# EAGLE design Peripherals (EAGLE 9.0.0)
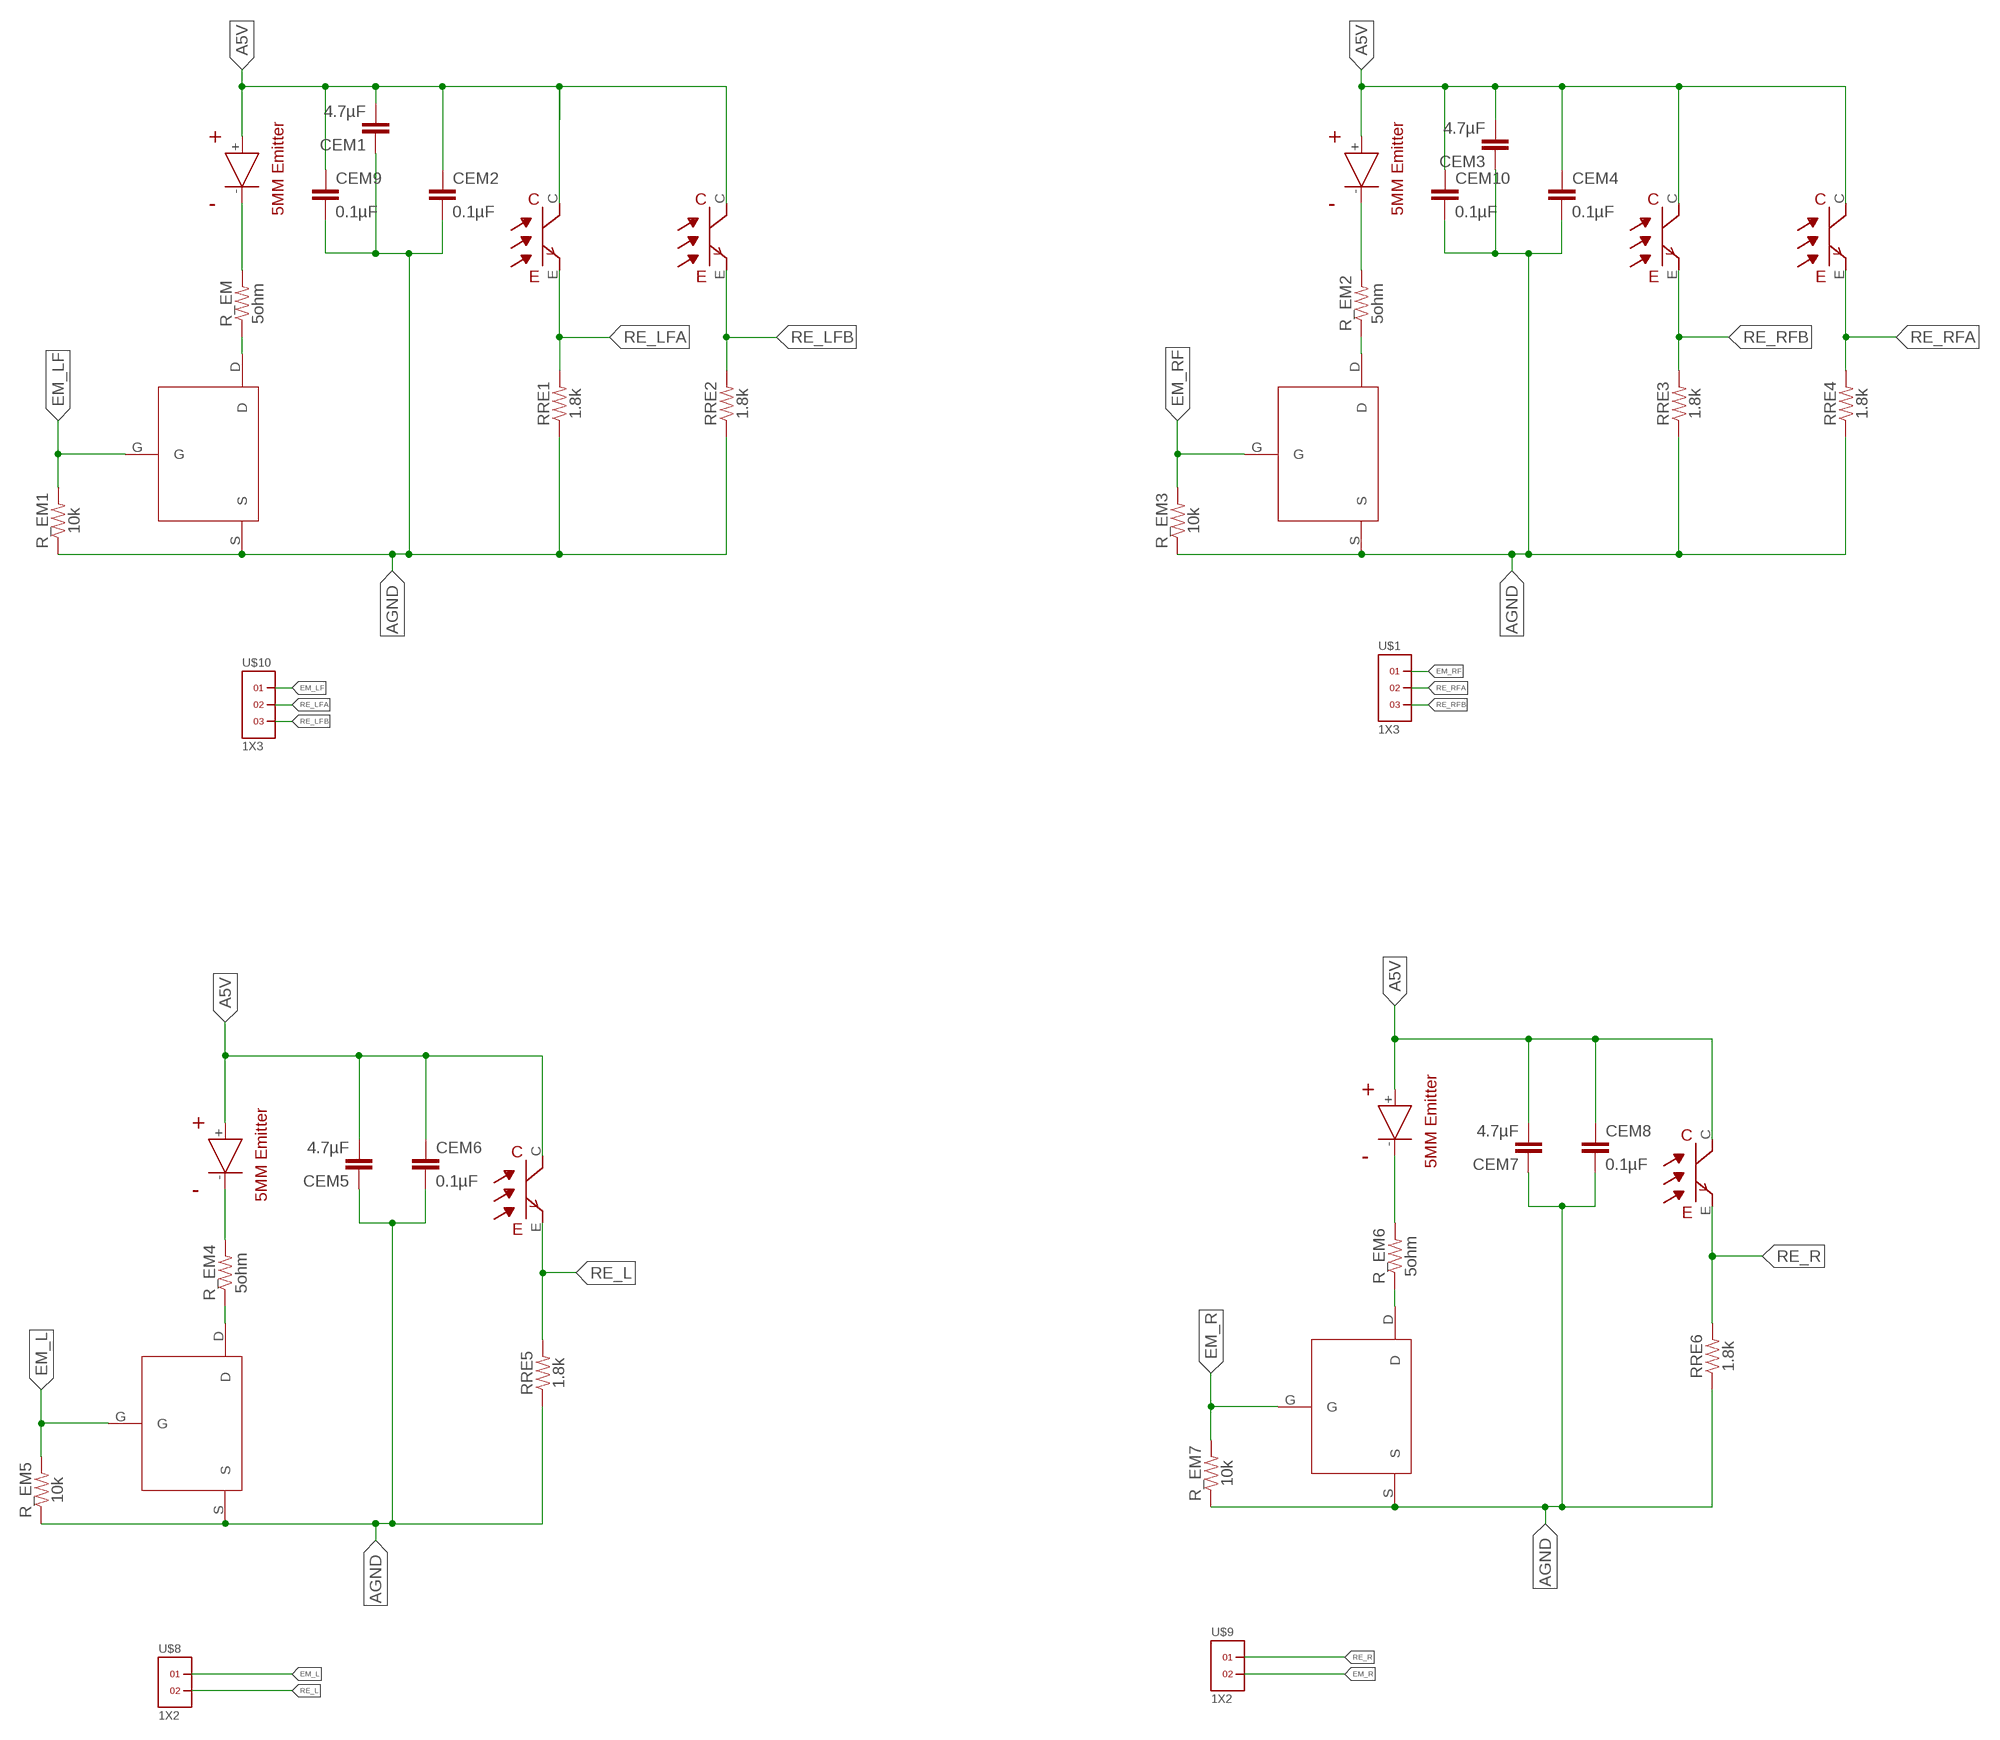
[diagram p0: schematic, sheet 1, part 1 of 2]
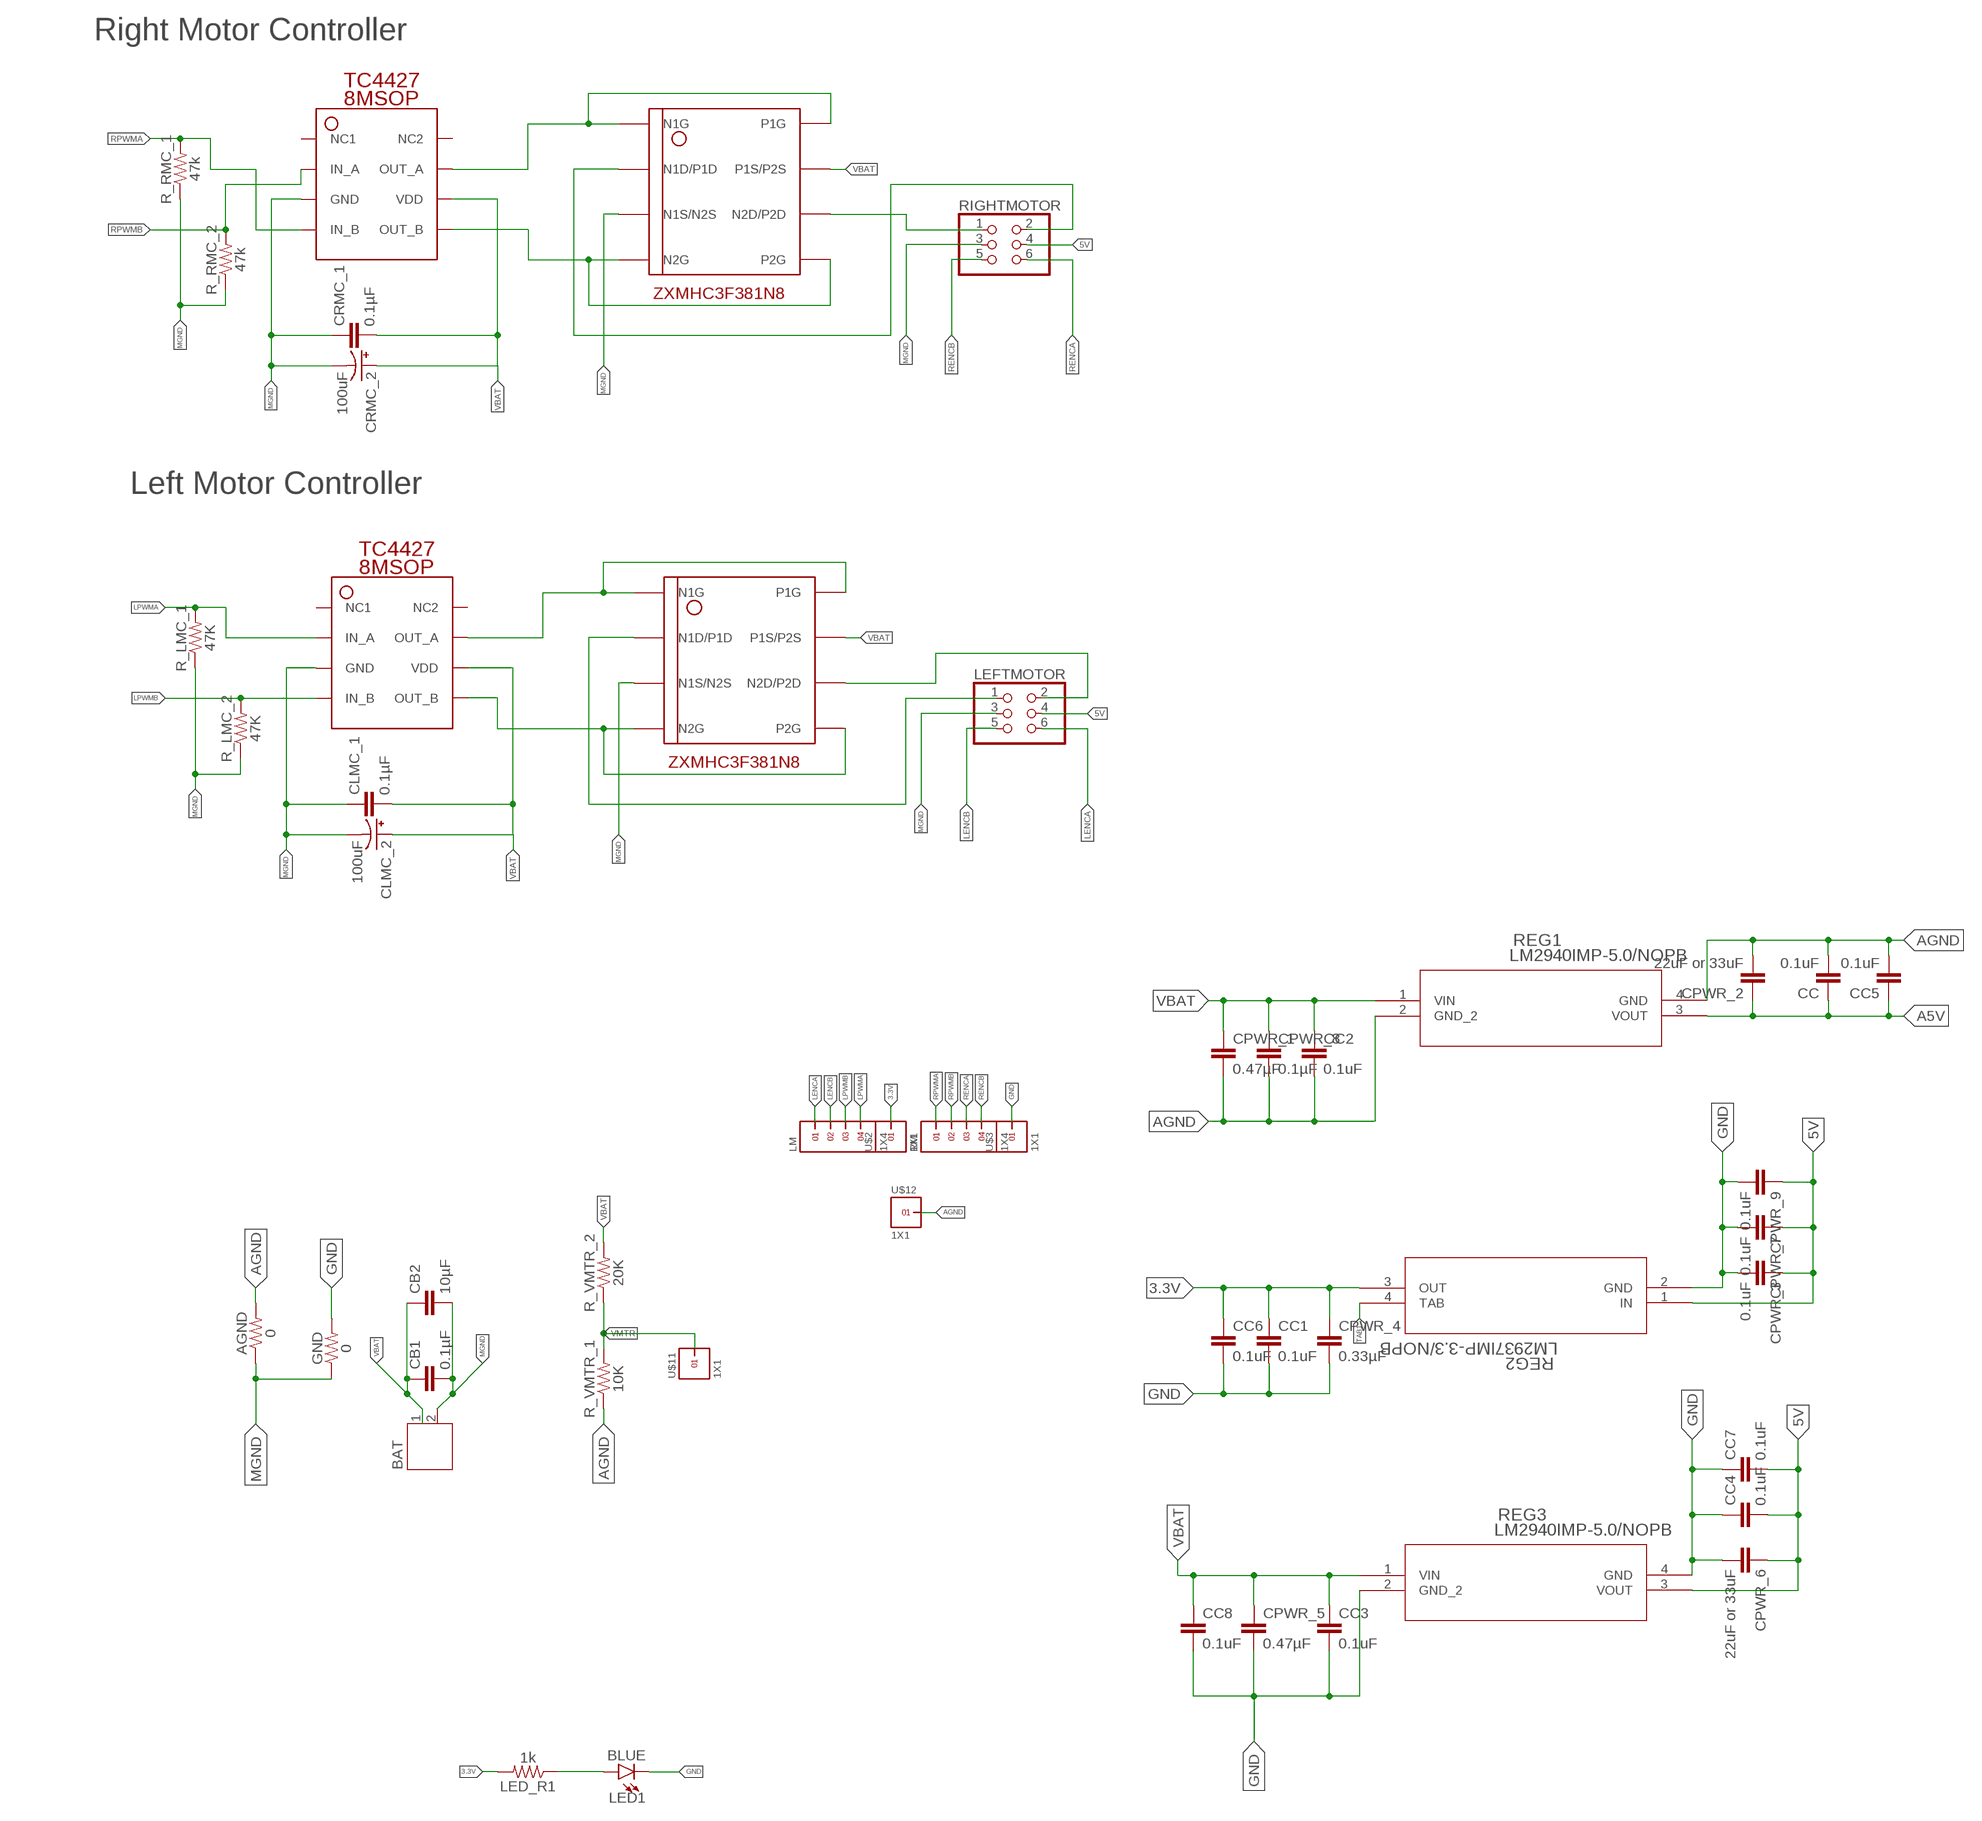
[diagram p1: schematic, sheet 1, part 2 of 2]

## Parts
AGND  0  0.75OHM-0805-1/4W-1%  [0805]
BAT  JST-PH2  [JST-PH2]
CB1  0.1µF  0.33UF/330NF-0805-50V-10%  [0805]
CB2  10µF  0.33UF/330NF-0805-50V-10%  [0805]
CC  0.1uF  0.33UF/330NF-0805-50V-10%  [0805]
CC1  0.1uF  0.33UF/330NF-0805-50V-10%  [0805]
CC2  0.1uF  0.33UF/330NF-0805-50V-10%  [0805]
CC3  0.1uF  0.33UF/330NF-0805-50V-10%  [0805]
CC4  0.1uF  0.33UF/330NF-0805-50V-10%  [0805]
CC5  0.1uF  0.33UF/330NF-0805-50V-10%  [0805]
CC6  0.1uF  0.33UF/330NF-0805-50V-10%  [0805]
CC7  0.1uF  0.33UF/330NF-0805-50V-10%  [0805]
CC8  0.1uF  0.33UF/330NF-0805-50V-10%  [0805]
CEM1  4.7µF  0.33UF/330NF-0805-50V-10%  [0805]
CEM2  0.1µF  0.33UF/330NF-0805-50V-10%  [0805]
CEM3  4.7µF  0.33UF/330NF-0805-50V-10%  [0805]
CEM4  0.1µF  0.33UF/330NF-0805-50V-10%  [0805]
CEM5  4.7µF  0.33UF/330NF-0805-50V-10%  [0805]
CEM6  0.1µF  0.33UF/330NF-0805-50V-10%  [0805]
CEM7  4.7µF  0.33UF/330NF-0805-50V-10%  [0805]
CEM8  0.1µF  0.33UF/330NF-0805-50V-10%  [0805]
CEM9  0.1µF  0.33UF/330NF-0805-50V-10%  [0805]
CEM10  0.1µF  0.33UF/330NF-0805-50V-10%  [0805]
CLMC_1  0.1µF  0.33UF/330NF-0805-50V-10%  [0805]
CLMC_2  100uF  100UF-POLAR-EIA7343-10V-10%(TANT)  [EIA7343]
CPWR_1  0.47µF  0.33UF/330NF-0805-50V-10%  [0805]
CPWR_2  22uF or 33uF  0.33UF/330NF-0805-50V-10%  [0805]
CPWR_3  0.1uF  0.33UF/330NF-0805-50V-10%  [0805]
CPWR_4  0.33µF  0.33UF/330NF-0805-50V-10%  [0805]
CPWR_5  0.47µF  0.33UF/330NF-0805-50V-10%  [0805]
CPWR_6  22uF or 33uF  0.33UF/330NF-0805-50V-10%  [0805]
CPWR_7  0.1uF  0.33UF/330NF-0805-50V-10%  [0805]
CPWR_8  0.1µF  0.33UF/330NF-0805-50V-10%  [0805]
CPWR_9  0.1uF  0.33UF/330NF-0805-50V-10%  [0805]
CRMC_1  0.1µF  0.33UF/330NF-0805-50V-10%  [0805]
CRMC_2  100uF  100UF-POLAR-EIA7343-10V-10%(TANT)  [EIA7343]
EM_L  EMITTER  [EMITTER]
EM_LF  EMITTER  [EMITTER]
EM_R  EMITTER  [EMITTER]
EM_RF  EMITTER  [EMITTER]
GND  0  0.75OHM-0805-1/4W-1%  [0805]
LED1  BLUE  LED-BLUE1206  [LED-1206]
LED_R1  1k  0.75OHM-0805-1/4W-1%  [0805]
LEFTMOTOR  PINHD-2X3  [2X03]
LM  1X4  [1X4]
R_EM  5ohm  0.75OHM-0805-1/4W-1%  [0805]
R_EM1  10k  0.75OHM-0805-1/4W-1%  [0805]
R_EM2  5ohm  0.75OHM-0805-1/4W-1%  [0805]
R_EM3  10k  0.75OHM-0805-1/4W-1%  [0805]
R_EM4  5ohm  0.75OHM-0805-1/4W-1%  [0805]
R_EM5  10k  0.75OHM-0805-1/4W-1%  [0805]
R_EM6  5ohm  0.75OHM-0805-1/4W-1%  [0805]
R_EM7  10k  0.75OHM-0805-1/4W-1%  [0805]
R_LMC_1  47K  0.75OHM-0805-1/4W-1%  [0805]
R_LMC_2  47K  0.75OHM-0805-1/4W-1%  [0805]
R_RMC_1  47k  0.75OHM-0805-1/4W-1%  [0805]
R_RMC_2  47k  0.75OHM-0805-1/4W-1%  [0805]
R_VMTR_1  10K  0.75OHM-0805-1/4W-1%  [0805]
R_VMTR_2  20K  0.75OHM-0805-1/4W-1%  [0805]
RE_L  RECEIVER  [RECEIVER]
RE_LFA  RECEIVER  [RECEIVER]
RE_LFB  RECEIVER  [RECEIVER]
RE_R  RECEIVER  [RECEIVER]
RE_RFA  RECEIVER  [RECEIVER]
RE_RFB  RECEIVER  [RECEIVER]
REG1  LM2940IMP-5.0/NOPB  [MP04A]
REG2  LM2937IMP-3.3/NOPB  [MP04A]
REG3  LM2940IMP-5.0/NOPB  [MP04A]
RIGHTMOTOR  PINHD-2X3  [2X03]
RM  1X4  [1X4]
RRE1  1.8k  0.75OHM-0805-1/4W-1%  [0805]
RRE2  1.8k  0.75OHM-0805-1/4W-1%  [0805]
RRE3  1.8k  0.75OHM-0805-1/4W-1%  [0805]
RRE4  1.8k  0.75OHM-0805-1/4W-1%  [0805]
RRE5  1.8k  0.75OHM-0805-1/4W-1%  [0805]
RRE6  1.8k  0.75OHM-0805-1/4W-1%  [0805]
U$1  1X3  [1X3]
U$2  1X1  [1X1]
U$3  1X1  [1X1]
U$4  MCH3474  [MCH3474]
U$5  MCH3474  [MCH3474]
U$6  MCH3474  [MCH3474]
U$7  MCH3474  [MCH3474]
U$8  1X2  [1X2]
U$9  1X2  [1X2]
U$10  1X3  [1X3]
U$11  1X1  [1X1]
U$12  1X1  [1X1]
U$15  TC4427(8MSOP)  [TC4427(8MSOP)]
U$16  ZXMHC3F381N8  [ZXMHC3F381N8]
U$17  TC4427(8MSOP)  [TC4427(8MSOP)]
U$18  ZXMHC3F381N8  [ZXMHC3F381N8]

## Nets
3.3V: CC1.1 CC6.1 CPWR_4.1 LED_R1.2 REG2.3(OUT) U$2.1
5V: CC4.2 CC7.2 CPWR_3.1 CPWR_6.1 CPWR_7.1 CPWR_9.1 LEFTMOTOR.4 REG2.1(IN) REG3.3(VOUT) RIGHTMOTOR.4
A5V: CC5.1 CC.1 CEM1.2 CEM2.1 CEM3.2 CEM4.1 CEM5.2 CEM6.1 CEM7.2 CEM8.1 CEM9.1 CEM10.1 CPWR_2.1 EM_L.+ EM_LF.+ EM_R.+ EM_RF.+ RE_L.C RE_LFA.C RE_LFB.C RE_R.C RE_RFA.C RE_RFB.C REG1.3(VOUT)
AGND: AGND.2 CC2.2 CC5.2 CC.2 CEM1.1 CEM2.2 CEM3.1 CEM4.2 CEM5.1 CEM6.2 CEM7.1 CEM8.2 CEM9.2 CEM10.2 CPWR_1.2 CPWR_2.2 CPWR_8.2 R_EM1.1 R_EM3.1 R_EM5.1 R_EM7.1 R_VMTR_1.1 REG1.2(GND_2) REG1.4(GND) RRE1.1 RRE2.1 RRE3.1 RRE4.1 RRE5.1 RRE6.1 U$4.S U$5.S U$6.S U$7.S U$12.1
EM_L: R_EM5.2 U$4.G U$8.1
EM_LF: R_EM1.2 U$5.G U$10.1
EM_R: R_EM7.2 U$7.G U$9.2
EM_RF: R_EM3.2 U$1.1 U$6.G
EMD_L: EM_L.- R_EM4.2
GND: CC1.2 CC3.2 CC4.1 CC6.2 CC7.1 CC8.2 CPWR_3.2 CPWR_4.2 CPWR_5.2 CPWR_6.2 CPWR_7.2 CPWR_9.2 GND.2 LED1.C REG2.2(GND) REG3.2(GND_2) REG3.4(GND) U$3.1
L: LEFTMOTOR.1 U$16.N1D/P1D
LENCA: LEFTMOTOR.6 LM.1
LENCB: LEFTMOTOR.5 LM.2
LPWMA: LM.4 R_LMC_1.2 U$15.IN_A
LPWMB: LM.3 R_LMC_2.2 U$15.IN_B
MGND: AGND.1 BAT.2 CB1.2 CB2.2 CLMC_1.1 CLMC_2.C(-) CRMC_1.1 CRMC_2.C(-) GND.1 LEFTMOTOR.3 R_LMC_1.1 R_LMC_2.1 R_RMC_1.1 R_RMC_2.1 RIGHTMOTOR.3 U$15.GND U$16.N1S/N2S U$17.GND U$18.N1S/N2S
N$1: R_EM.1 U$5.D
N$2: R_EM2.1 U$6.D
N$3: R_EM4.1 U$4.D
N$4: R_EM6.1 U$7.D
N$5: EM_LF.- R_EM.2
N$6: EM_RF.- R_EM2.2
N$7: EM_R.- R_EM6.2
N$8: LED1.A LED_R1.1
N$28: LEFTMOTOR.2 U$16.N2D/P2D
N$36: RIGHTMOTOR.1 U$18.N2D/P2D
OUT_A: U$15.OUT_A U$16.N1G U$16.P1G
OUT_B: U$15.OUT_B U$16.N2G U$16.P2G
OUTA: U$17.OUT_A U$18.N1G U$18.P1G
OUTB: U$17.OUT_B U$18.N2G U$18.P2G
R: RIGHTMOTOR.2 U$18.N1D/P1D
RE_L: RE_L.E RRE5.2 U$8.2
RE_LFA: RE_LFA.E RRE1.2 U$10.2
RE_LFB: RE_LFB.E RRE2.2 U$10.3
RE_R: RE_R.E RRE6.2 U$9.1
RE_RFA: RE_RFB.E RRE4.2 U$1.2
RE_RFB: RE_RFA.E RRE3.2 U$1.3
RENCA: RIGHTMOTOR.6 RM.3
RENCB: RIGHTMOTOR.5 RM.4
RPWMA: R_RMC_1.2 RM.1 U$17.IN_B
RPWMB: R_RMC_2.2 RM.2 U$17.IN_A
TAB1: REG2.4(TAB)
VBAT: BAT.1 CB1.1 CB2.1 CC2.1 CC3.1 CC8.1 CLMC_1.2 CLMC_2.A(+) CPWR_1.1 CPWR_5.1 CPWR_8.1 CRMC_1.2 CRMC_2.A(+) R_VMTR_2.2 REG1.1(VIN) REG3.1(VIN) U$15.VDD U$16.P1S/P2S U$17.VDD U$18.P1S/P2S
VMTR: R_VMTR_1.2 R_VMTR_2.1 U$11.1
Unconnected: U$15.NC1 U$15.NC2 U$17.NC1 U$17.NC2

## Notes on the sheet
- Right Motor Controller
- Left Motor Controller

## Library data of the parts
AGND GND LED_R1 R_EM R_EM1-R_EM7 R_LMC_1 R_LMC_2 R_RMC_1 R_RMC_2 R_VMTR_1 R_VMTR_2 RRE1-RRE6 = SparkFun-Resistors:0.75OHM: 0.75Ω resistor A resistor is a passive two-terminal electrical component that implements electrical resistance as a circuit element. Resistors act to reduce current flow, and, at the same time, act to lower voltage levels within circuits. - Wikipedia; PROD_ID: RES-08474; VALUE: 0.75
BAT = jst-ph:JST-PH2
CB1 CB2 CC CC1-CC8 CEM1-CEM10 CLMC_1 CPWR_1-CPWR_3 CPWR_5-CPWR_9 CRMC_1 = SparkFun-Capacitors:0.33UF/330NF: 0.33µF/330nF ceramic capacitors A capacitor is a passive two-terminal electrical component used to store electrical energy temporarily in an electric field.; PROD_ID: CAP-08469; VALUE: 0.33µF
CLMC_2 CRMC_2 = SparkFun-Capacitors:100UF-POLAR: 100µF polarized capacitors A capacitor is a passive two-terminal electrical component used to store electrical energy temporarily in an electric field.; PROD_ID: CAP-07890
CPWR_4 = SparkFun-Capacitors:0.33UF/330NF: 0.33µF/330nF ceramic capacitors A capacitor is a passive two-terminal electrical component used to store electrical energy temporarily in an electric field.; PROD_ID: CAP-08469
EM_L EM_LF EM_R EM_RF = sfh4550 & teft4300:EMITTER
LED1 = SparkFun-LED:LED-BLUE: Blue SMD LED Used in manufacturing of various products at SparkFun Packages: 0603 - SMD 0603 package [Product Link] <http://www.digikey.com/product-detail/en/SMLE12BC7TT86/511-1589-2-ND/1641808> 1206 - SMD1206 package [Product Link] <http://www.digikey.com/product-detail/en/lite-on-inc/LTST-C150TBKT/160-1643-1-ND/573584> SparkFun Products: ESP8266 Thing-Dev Board <https://www.sparkfun.com/products/13711> RedBoard <https://www.sparkfun.com/products/12757>; PROD_ID: DIO-09911
LEFTMOTOR RIGHTMOTOR = pinhead:PINHD-2X3: PIN HEADER
LM RM = headers(2mm):1X4
RE_L RE_LFA RE_LFB RE_R RE_RFA RE_RFB = sfh4550 & teft4300:RECEIVER
REG1 REG3 = LM2940IMP-5.0:LM2940IMP-5.0/NOPB; 3D_LIBRARY_NAME: National_LDO; BASE_PN: LM2940; COMP: TypeLDO; COPYRIGHT: Copyright C 2015 Accelerated Designs. All rights reserved; LIBRARY: ReferenceLM2940IMP; MANUFACTURER_PART_NUMBER: LM2940IMP5.0NOPB; PIN: Count4; SYMBOL: NameLM2940IMP50; TYPE: LM2940IMP5.0; VENDOR: National Semiconductor; VERSION: 1
REG2 = LM2937IMP-3.3:LM2937IMP-3.3/NOPB; COPYRIGHT: Copyright C 2015 Accelerated Designs. All rights reserved; MANUFACTURER_PART_NUMBER: lm2937imp3_3nopb; VENDOR: National Semiconductor
U$1 U$10 = headers(2mm):1X3
U$2 U$3 U$11 U$12 = headers(2mm):1X1
U$4-U$7 = MCH3474:MCH3474
U$8 U$9 = headers(2mm):1X2
U$15 U$17 = TC4427(8MSOP):TC4427(8MSOP)
U$16 U$18 = ZXMHC3F381N8:ZXMHC3F381N8

## Board
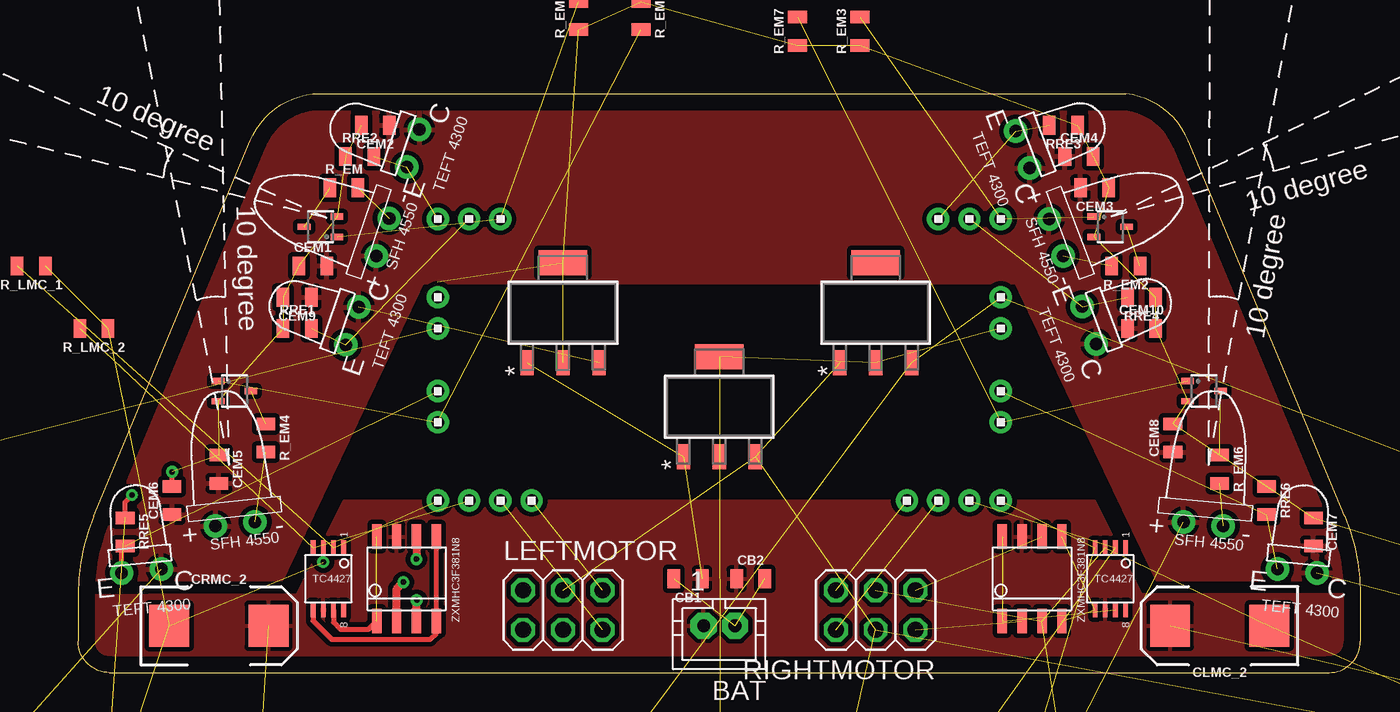
[diagram p2: board, top side]
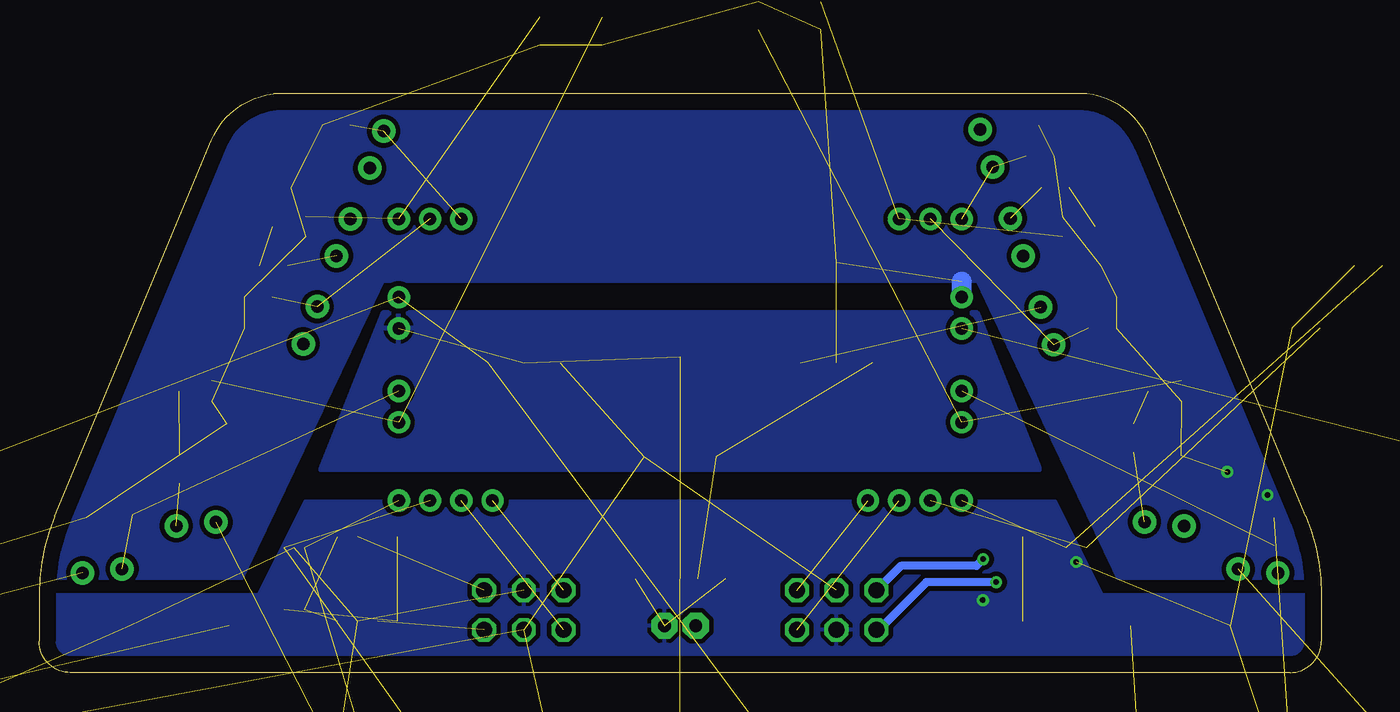
[diagram p3: board, bottom side, seen from below]

Size 82 x 37 mm. Coordinates in mm from the lower left corner, seen from the top.
Outline: 2,0 80,0 arc90 82,2 82,5 arc23 81,10 71,34 arc61 67,37 15,37 arc61 11,34 1,10 arc23 0,5 0,2 arc90 2,0
Copper layers (1*16): Top 0.035mm / dielectric 1.5mm / Bottom 0.035mm
Design rules "default": minimum track width 6mil, minimum drill 0.35mm, track to track 6mil, track to pad 6mil, pad to pad 6mil, via to via 6mil, smd to smd 6mil, copper to edge 40mil, drill to drill 6mil, minimum pad ring 10mil, minimum via ring 8mil, stop-mask expansion 4mil, vias tented up to drill 0mil, thermal gap 10mil

### Footprints (pad centres in the part's own frame; a part is rotated, then mirrored left to right if it is on the bottom)
0805 = smd 0.8 x 1.2: 1 -0.9,0; 2 0.9,0
JST-PH2 = drill 0.813 pad 1.676 octagon: 1 1,0; 2 -1,0
EIA7343 = smd 2.55 x 2.7: A 3.17,0; C -3.17,0
EMITTER = drill 0.8 pad 1.5: + -1.27,-0.5; - 1.27,-0.5
LED-1206 = smd 1.2 x 1.4: A -1.5,0; C 1.5,0
2X03 = drill 1.016 octagon: 1 -2.54,-1.27; 2 -2.54,1.27; 3 0,-1.27; 4 0,1.27; 5 2.54,-1.27; 6 2.54,1.27
1X4 = drill 0.8 pad 1.422: 1 -3,0; 2 -1,0; 3 1,0; 4 3,0
RECEIVER = drill 0.8 pad 1.5: C 1.27,-0.5; E -1.27,-0.5
MP04A = smd 1.6 x 0.838: 1 -3.2,2.3; 2 -3.2,0; 3 -3.2,-2.3 | smd 1.6 x 3.099: 4 3.2,0
1X3 = drill 0.8 pad 1.422: 1 -2,0; 2 0,0; 3 2,0
1X1 = drill 0.8 pad 1.422: 1 0,0
MCH3474 = smd 0.406 x 0.813: D 0,1.05; G -0.65,-1.05; S 0.65,-1.05
1X2 = drill 0.8 pad 1.422: 1 -1,0; 2 1,0
TC4427(8MSOP) = smd 0.95 x 0.3: GND -1.975,-0.325; IN_A -1.975,0.325; IN_B -1.975,-0.975; NC1 -1.975,0.975; NC2 1.975,0.975; OUT_A 1.975,0.325; OUT_B 1.975,-0.975; VDD 1.975,-0.325
ZXMHC3F381N8 = smd 0.6 x 1.55: N1D/P1D -0.635,-2.7; N1G -1.905,-2.7; N1S/N2S 0.635,-2.7; N2D/P2D 0.635,2.7; N2G 1.905,-2.7; P1G -1.905,2.7; P1S/P2S -0.635,2.7; P2G 1.905,2.7

### Placement (x,y rotation side)
AGND  -19,-33 180 top  (outside the outline)
BAT  41,3 180 top
CB1  39,6 180 top
CB2  43,6 0 top
CC  -31,-33 180 top  (outside the outline)
CC1  -35,-33 180 top  (outside the outline)
CC2  -39,-33 180 top  (outside the outline)
CC3  -43,-33 180 top  (outside the outline)
CC4  -47,-33 180 top  (outside the outline)
CC5  171,-18 180 top  (outside the outline)
CC6  167,-18 180 top  (outside the outline)
CC7  163,-18 180 top  (outside the outline)
CC8  159,-18 180 top  (outside the outline)
CEM1  15,26 0 top
CEM2  19,35 180 top
CEM3  65,31 180 top
CEM4  64,33 0 top
CEM5  9,13 270 top
CEM6  6,11 90 top
CEM7  79,9 270 top
CEM8  70,15 90 top
CEM9  14,24 180 top
CEM10  68,22 0 top
CLMC_1  -15,-33 180 top  (outside the outline)
CLMC_2  73,3 180 top
CPWR_1  21,-33 180 top  (outside the outline)
CPWR_2  48,-33 180 top  (outside the outline)
CPWR_3  17,-33 180 top  (outside the outline)
CPWR_4  13,-33 180 top  (outside the outline)
CPWR_5  9,-33 180 top  (outside the outline)
CPWR_6  42,-33 180 top  (outside the outline)
CPWR_7  5,-33 180 top  (outside the outline)
CPWR_8  1,-33 180 top  (outside the outline)
CPWR_9  -3,-33 180 top  (outside the outline)
CRMC_1  -7,-33 180 top  (outside the outline)
CRMC_2  9,3 0 top
EM_L  10,10 6.2 top
EM_LF  19,28 71.1 top
EM_R  72,10 354.8 top
EM_RF  63,28 290.7 top
GND  123,-18 180 top  (outside the outline)
LED1  54,-33 180 top  (outside the outline)
LED_R1  -11,-33 180 top  (outside the outline)
LEFTMOTOR  31,4 0 top
LM  26,11 180 top
R_EM  17,31 0 top
R_EM1  32,42 90 top  (outside the outline)
R_EM2  67,26 180 top
R_EM3  50,41 90 top  (outside the outline)
R_EM4  12,15 270 top
R_EM5  36,42 270 top  (outside the outline)
R_EM6  73,13 270 top
R_EM7  46,41 90 top  (outside the outline)
R_LMC_1  -3,26 180 top
R_LMC_2  1,22 180 top
R_RMC_1  62,-5 180 top  (outside the outline)
R_RMC_2  58,-5 180 top  (outside the outline)
R_VMTR_1  -212,-38 0 top  (outside the outline)
R_VMTR_2  -212,-42 0 top  (outside the outline)
RE_L  4,7 5.4 top
RE_LFA  17.06,22.32 71.1 top
RE_LFB  20.94,33.68 71.1 top
RE_R  78,7 354.3 top
RE_RFA  60.88,33.61 290.7 top
RE_RFB  65.12,22.39 290.7 top
REG1  31,23 90 top
REG2  51,23 90 top
REG3  41,17 90 top
RIGHTMOTOR  51,4 180 top
RM  56,11 180 top
RRE1  14,22 0 top
RRE2  18,33 0 top
RRE3  63,35 180 top
RRE4  68,24 180 top
RRE5  3,9 270 top
RRE6  76,11 270 top
U$1  57,29 180 top
U$2  59,24 0 top
U$3  59,22 0 top
U$4  10,18 270 top
U$5  15.5,28.5 90 top
U$6  66,28.5 270 top
U$7  72,18 270 top
U$8  23,17 90 top
U$9  59,17 270 top
U$10  25,29 180 top
U$11  23,22 0 top
U$12  23,24 0 top
U$15  16,6 270 top
U$16  21,6 0 top
U$17  66,6 270 top
U$18  61,6 0 top

### Tracks (layer width: path | path; a pad name or v marks a point on that pad's centre or on a via)
3.3V  (5 unrouted)
5V  (9 unrouted)
A5V  (4 unrouted)
  pour Top (isolate 0.305): -4,6 13,6 22,25 60,25 69,6 84,6 70,38 11,38
AGND  (via drill 0.35)  (32 unrouted)
  Top 0.305: RRE5.1 3,10.91 v3.44,11.35 | CEM6.2 v6,12.83 v6.01,12.84
  Bottom 1.27: U$12.1 23,25
  pour Bottom (isolate 0.305): -4,6 13,6 22,25 60,25 69,6 84,6 82,10 70,38 12,38
EM_L  (2 unrouted)
EM_LF  (2 unrouted)
EM_R  (2 unrouted)
EM_RF  (2 unrouted)
EMD_L  (1 unrouted)
GND  (17 unrouted)
  pour Bottom (isolate 0.305): 18,13 22,23 60,23 64,13
L  (via drill 0.35)
  Top 0.508: U$16.N1D/P1D 20.37,5.35 v20.79,5.78
  Bottom 0.508: LEFTMOTOR.1 28.39,2.66 25.27,5.78 v20.79,5.78
LENCA  (1 unrouted)
LENCB  (1 unrouted)
LPWMA  (2 unrouted)
LPWMB  (2 unrouted)
MGND  (via drill 0.35)  (14 unrouted)
  Top 0.305: U$15.GND v15.67,7.08 v15.67,7.07
  Top 0.508: U$16.N1S/N2S 21.63,3.62 v21.65,4.63
  pour Bottom (isolate 0.305): -4,-1 -4,5 14,5 17,11 65,11 68,5 84,5 84,-1
N$1  (1 unrouted)
N$2  (1 unrouted)
N$3  (1 unrouted)
N$4  (1 unrouted)
N$5  (1 unrouted)
N$6  (1 unrouted)
N$7  (1 unrouted)
N$8  (1 unrouted)
N$28  (via drill 0.35)
  Top 0.508: U$16.N2D/P2D v21.63,7.26 v21.63,7.25
  Bottom 0.508: v21.63,7.25 22.05,6.83 26.9,6.83 LEFTMOTOR.2
N$36  (1 unrouted)
OUT_A  (1 unrouted)
  Top 0.305: U$15.OUT_A 16.33,3.2 16.75,2.78 18.58,2.78 U$16.N1G
OUT_B
  Top 0.305: U$16.P2G U$16.N2G 22.91,2.53 22.5,2.12 16.22,2.12 15.02,3.31 U$15.OUT_B
OUTA  (2 unrouted)
OUTB  (2 unrouted)
R  (1 unrouted)
RE_L  (1 unrouted)
  Top 0.305: RE_L.E 2.78,7.88 RRE5.2
RE_LFA  (2 unrouted)
RE_LFB  (2 unrouted)
RE_R  (2 unrouted)
RE_RFA  (2 unrouted)
RE_RFB  (2 unrouted)
RENCA  (1 unrouted)
RENCB  (1 unrouted)
RPWMA  (2 unrouted)
RPWMB  (2 unrouted)
VBAT  (11 unrouted)
  pour Top (isolate 0.305): -4,0 -4.98,4.94 14,5 17,11 65,11 68,5 84,5 84,-1 -4,-1
VMTR  (2 unrouted)